# EAGLE schematic Joystick (EAGLE 6.5.0)
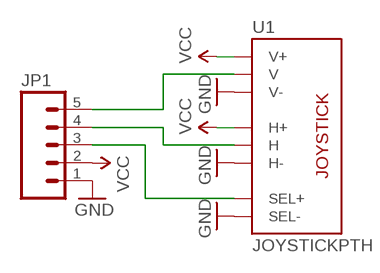
[diagram p0: schematic, sheet 1]

## Parts
JP1  M05PTH  [1X05]
U1  JOYSTICKPTH  [JOYSTICK]

## Nets
B: JP1.3 U1.B1A(SEL+)
GND: JP1.1 U1.B2A(SEL-) U1.H3(H-) U1.V3(V-)
H: JP1.4 U1.H2(H)
V: JP1.5 U1.V2(V)
VCC: JP1.2 U1.H1(H+) U1.V1(V+)

## Library data of the parts
JP1 = SparkFun-Connectors:M05: Header 5 Standard 5-pin 0.1" header. Use with straight break away headers (SKU : PRT-00116), right angle break away headers (PRT-00553), swiss pins (PRT-00743), machine pins (PRT-00117), and female headers (PRT-00115). Molex polarized connector foot print use with SKU : PRT-08230 with associated crimp pins and housings.
U1 = SparkFun-Electromechanical:JOYSTICK: Thumb Joystick Joystick commonly found in PS2 controllers. Two pots and a select switch. Footprint proven. Spark Fun Electronics SKU : COM-09032